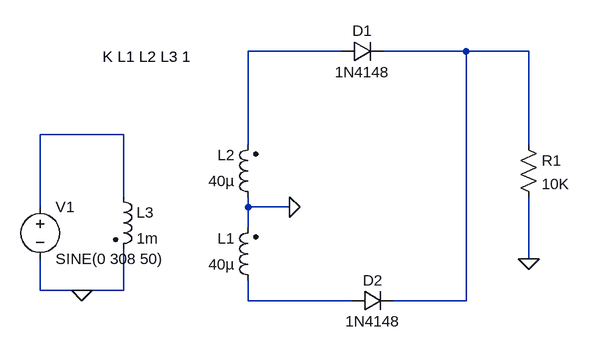
[diagram p0: schematic CENTER tap full wave.asc]
CENTER tap full wave.asc, the LTspice schematic file:
Version 4
SHEET 1 880 680
WIRE 432 -96 288 -96
WIRE 624 -96 496 -96
WIRE 720 -96 624 -96
WIRE 96 32 -32 32
WIRE 288 48 288 -96
WIRE 720 48 720 -96
WIRE 96 128 96 32
WIRE -32 144 -32 32
WIRE 288 144 288 128
WIRE 352 144 288 144
WIRE 288 176 288 144
WIRE 720 224 720 128
WIRE -32 272 -32 224
WIRE 32 272 -32 272
WIRE 96 272 96 208
WIRE 96 272 32 272
WIRE 288 288 288 256
WIRE 448 288 288 288
WIRE 624 288 624 -96
WIRE 624 288 512 288
FLAG 32 272 0
FLAG 352 144 0
FLAG 720 224 0
SYMBOL voltage -32 128 R0
WINDOW 123 0 0 Left 2
WINDOW 39 0 0 Left 2
SYMATTR InstName V1
SYMATTR Value SINE(0 308 50)
SYMBOL ind2 304 272 R180
WINDOW 0 36 80 Left 2
WINDOW 3 36 40 Left 2
SYMATTR InstName L1
SYMATTR Value 40µ
SYMBOL ind2 304 144 R180
WINDOW 0 36 80 Left 2
WINDOW 3 36 40 Left 2
SYMATTR InstName L2
SYMATTR Value 40µ
SYMBOL ind2 80 112 R0
SYMATTR InstName L3
SYMATTR Value 1m
SYMBOL diode 432 -80 R270
WINDOW 0 32 32 VTop 2
WINDOW 3 0 32 VBottom 2
SYMATTR InstName D1
SYMATTR Value 1N4148
SYMBOL diode 448 304 R270
WINDOW 0 32 32 VTop 2
WINDOW 3 0 32 VBottom 2
SYMATTR InstName D2
SYMATTR Value 1N4148
SYMBOL res 704 32 R0
SYMATTR InstName R1
SYMATTR Value 10K
TEXT 64 -88 Left 2 !K L1 L2 L3 1

The netlist it stands for:
* CENTER tap full wave.asc
V1 N003 0 SINE(0 308 50)
L1 N004 0 40µ
L2 0 N001 40µ
L3 N003 0 1m
D1 N001 N002 1N4148
D2 N004 N002 1N4148
R1 N002 0 10K
.model D D
.lib standard.dio
K L1 L2 L3 1
.backanno
.end